# Altium schematic sheet 8051.SchDoc
size A3
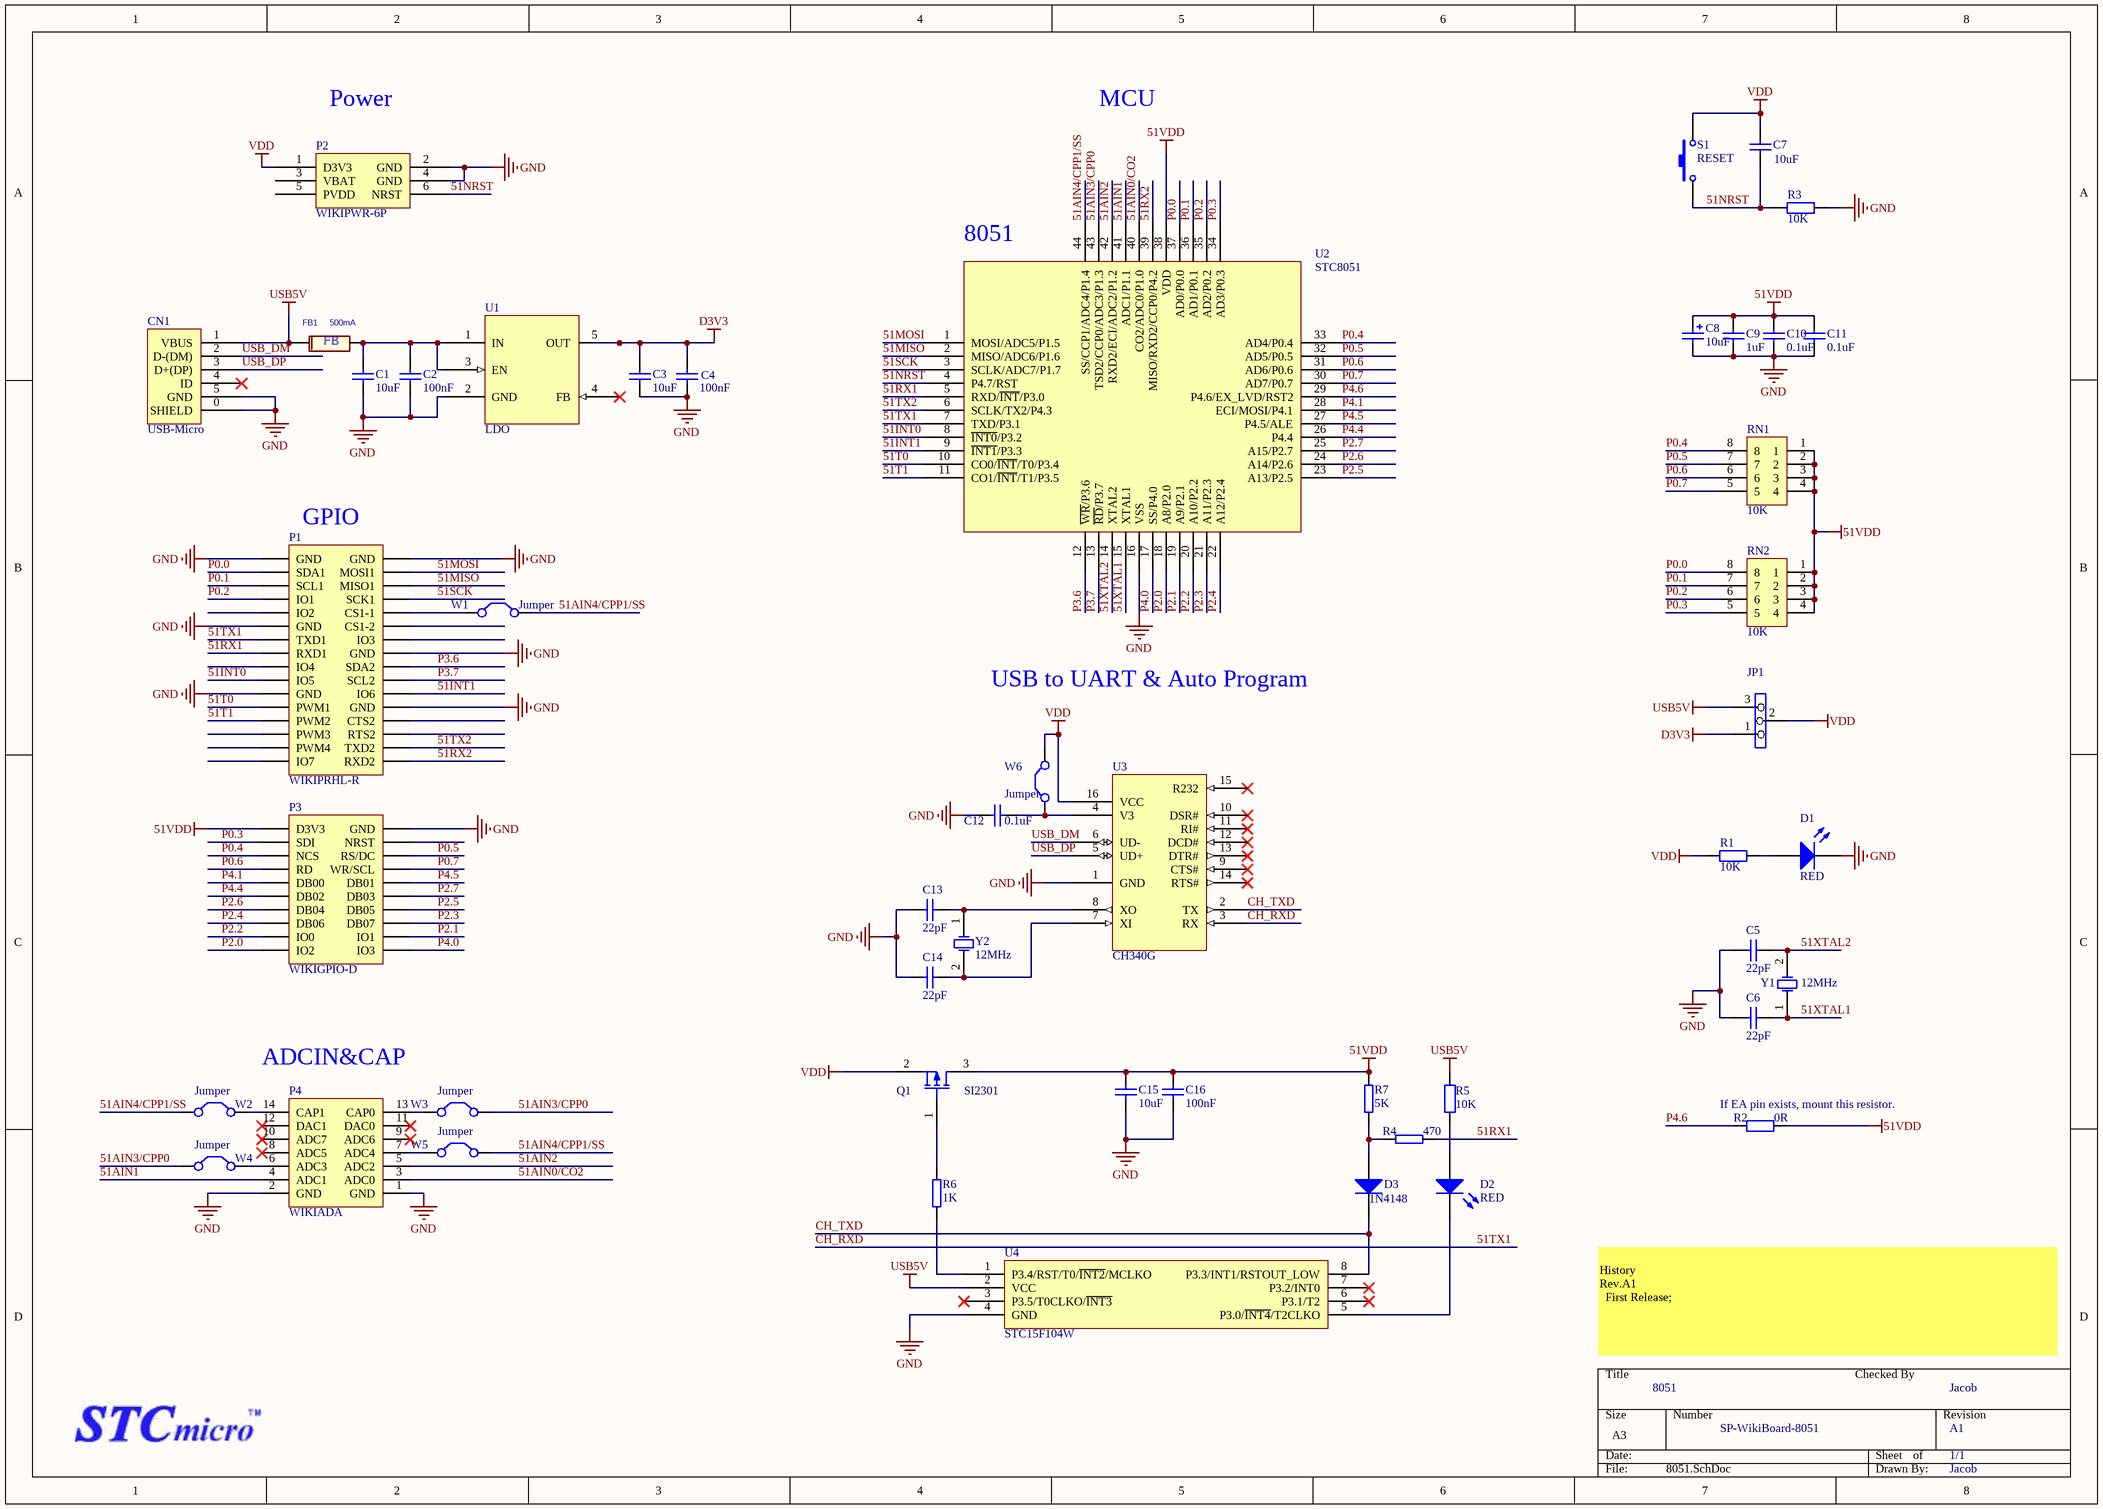
[diagram p0: 8051.SchDoc]

## Parts
C1  10uF  [C0805]
C2  100nF  [C0603L]
C3  10uF  [C0805]
C4  100nF  [C0603L]
C5  22pF  [C0603L]
C6  22pF  [C0603L]
C7  10uF  [C0805]
C8  10uF  [SMT_C_Tantalum_B]
C9  1uF  [C0603L]
C10  0.1uF  [C0603L]
C11  0.1uF  [C0603L]
C12  0.1uF  [C0603L]
C13  22pF  [C0603L]
C14  22pF  [C0603L]
C15  10uF  [C0805]
C16  100nF  [C0603L]
CN1  USB-Micro  [USB_MICRO_5S_B]
D1  RED  [SMT_LED_0603]
D2  RED  [SMT_LED_0603]
D3  1N4148  [SOD80]
FB1  500mA  [R1206]
JP1  JP3  [SIP3]  (value not drawn)
P1  WIKIPRHL-R  [WIKIPRHL-R]
P2  WIKIPWR-6P  [WIKIPWR-6P]
P3  WIKIGPIO-D  [WIKIGPIO-D]
P4  WIKIADA  [WIKIADA]
Q1  SI2301  [SOT-23A]
R1  10K  [R0603]
R2  0R  [R0603]
R3  10K  [R0603]
R4  470  [R0603]
R5  10K  [R0603]
R6  1K  [R0603]
R7  5K  [R0603]
RN1  value 10K  [RN1X4/0603]  (hidden comment: RN4)
RN2  value 10K  [RN1X4/0603]  (hidden comment: RN4)
S1  RESET  [KEY-2x4-SMD]
U1  LDO  [SOT23-5]
U2  STC8051  [TQFP44]
U3  CH340G  [SO16_M]
U4  STC15F104W  [SO8_M]
W1  Jumper  [Solderbridge]
W2  Jumper  [Solderbridge]
W3  Jumper  [Solderbridge]
W4  Jumper  [Solderbridge]
W5  Jumper  [Solderbridge]
W6  Jumper  [Solderbridge]
Y1  12MHz  [XTAL0602]
Y2  12MHz  [XTAL_32]

## Nets
51VDD: C8.1 C9.2 C10.2 C11.2 C15.1 C16.1 P3.1(D3V3) Q1.3(D) R2.2 R7.1 RN1.1 RN1.2 RN1.3 RN1.4 RN2.1 RN2.2 RN2.3 RN2.4 U2.38(VDD)
D3V3: C3.1 C4.1 JP1.1 U1.5(OUT)
GND: C1.2 C2.2 C3.2 C4.2 C5.1 C6.1 C8.2 C9.1 C10.1 C11.1 C12.1 C13.1 C14.1 C15.2 C16.2 CN1.0(SHIELD) CN1.5(GND) D1.2(K) P1.1(GND) P1.2(GND) P1.11(GND) P1.16(GND) P1.21(GND) P1.24(GND) P2.2(GND) P2.4(GND) P3.2(GND) P4.1(GND) P4.2(GND) R3.1 U1.2(GND) U2.16(VSS) U3.1(GND) U4.4(GND)
USB5V: CN1.1(VBUS) FB1.1 JP1.3 R5.2 U4.2(VCC)
VDD: C7.2 JP1.2 P2.1(D3V3) Q1.2(S) R1.2 S1.2 U3.16(VCC) W6.1(C1)
51AIN0/CO2: P4.3(ADC0) U2.40(CO2/ADC0/P1.0)
51AIN1: P4.4(ADC1) U2.41(ADC1/P1.1)
51AIN2: P4.5(ADC2) U2.42(RXD2/ECI/ADC2/P1.2)
51AIN3/CPP0: U2.43(TSD2/CCP0/ADC3/P1.3) W3.2(C2) W4.1(C1)
51AIN4/CPP1/SS: U2.44(SS/CCP1/ADC4/P1.4) W1.1(C1) W2.1(C1) W5.2(C2)
51INT0: P1.19(IO5) U2.8(~{INT0}/P3.2)
51INT1: P1.22(IO6) U2.9(~{INT1}/P3.3)
51MISO: P1.6(MISO1) U2.2(MISO/ADC6/P1.6)
51MOSI: P1.4(MOSI1) U2.1(MOSI/ADC5/P1.5)
51NRST: C7.1 P2.6(NRST) R3.2 S1.1 U2.4(P4.7/RST)
51RX1: P1.15(RXD1) R4.2 U2.5(RXD/~{INT}/P3.0)
51RX2: P1.32(RXD2) U2.39(MISO/RXD2/CCP0/P4.2)
51SCK: P1.8(SCK1) U2.3(SCLK/ADC7/P1.7)
51T0: P1.23(PWM1) U2.10(CO0/~{INT}/T0/P3.4)
51T1: P1.25(PWM2) U2.11(CO1/~{INT}/T1/P3.5)
51TX1: P1.13(TXD1) U2.7(TXD/P3.1) U3.3(RX)  [also labelled CH_RXD]
51TX2: P1.30(TXD2) U2.6(SCLK/TX2/P4.3)
51XTAL1: C6.2 U2.15(XTAL1) Y1.1(OSC1)
51XTAL2: C5.2 U2.14(XTAL2) Y1.2(OSC2)
CH_TXD: D3.2(K) U3.2(TX) U4.8(P3.3/INT1/RSTOUT_LOW)
P0.0: P1.3(SDA1) RN2.8 U2.37(AD0/P0.0)
P0.1: P1.5(SCL1) RN2.7 U2.36(AD1/P0.1)
P0.2: P1.7(IO1) RN2.6 U2.35(AD2/P0.2)
P0.3: P3.3(SDI) RN2.5 U2.34(AD3/P0.3)
P0.4: P3.5(NCS) RN1.8 U2.33(AD4/P0.4)
P0.5: P3.6(RS/DC) RN1.7 U2.32(AD5/P0.5)
P0.6: P3.7(RD) RN1.6 U2.31(AD6/P0.6)
P0.7: P3.8(WR/SCL) RN1.5 U2.30(AD7/P0.7)
P2.0: P3.19(IO2) U2.18(A8/P2.0)
P2.1: P3.18(IO1) U2.19(A9/P2.1)
P2.2: P3.17(IO0) U2.20(A10/P2.2)
P2.3: P3.16(DB07) U2.21(A11/P2.3)
P2.4: P3.15(DB06) U2.22(A12/P2.4)
P2.5: P3.14(DB05) U2.23(A13/P2.5)
P2.6: P3.13(DB04) U2.24(A14/P2.6)
P2.7: P3.12(DB03) U2.25(A15/P2.7)
P3.6: P1.18(SDA2) U2.12(~{WR}/P3.6)
P3.7: P1.20(SCL2) U2.13(~{RD}/P3.7)
P4.0: P3.20(IO3) U2.17(SS/P4.0)
P4.1: P3.9(DB00) U2.28(ECI/MOSI/P4.1)
P4.4: P3.11(DB02) U2.26(P4.4)
P4.5: P3.10(DB01) U2.27(P4.5/ALE)
P4.6: R2.1 U2.29(P4.6/EX_LVD/RST2)
USB_DM: CN1.2(D-(DM)) U3.6(UD-)
USB_DP: CN1.3(D+(DP)) U3.5(UD+)
NetC1_1: C1.1 C2.1 FB1.2 U1.1(IN) U1.3(EN)
NetC12_2: C12.2 U3.4(V3) W6.2(C2)
NetC13_2: C13.2 U3.8(XO) Y2.1(OSC1)
NetC14_2: C14.2 U3.7(XI) Y2.2(OSC2)
NetD1_1: D1.1(A) R1.1
NetD2_1: D2.1(A) R5.1
NetD2_2: D2.2(K) U4.5(P3.0/~{INT4}/T2CLKO)
NetD3_1: D3.1(A) R4.1 R7.2
NetP1_10: P1.10(CS1-1) W1.2(C2)
NetP4_6: P4.6(ADC3) W4.2(C2)
NetP4_7: P4.7(ADC4) W5.1(C1)
NetP4_13: P4.13(CAP0) W3.1(C1)
NetP4_14: P4.14(CAP1) W2.2(C2)
NetQ1_1: Q1.1(G) R6.2
NetR6_1: R6.1 U4.1(P3.4/RST/T0/~{INT2}/MCLKO)

Not connected (* = marked no-connect by the designer): CN1 4(ID)*; P1 9(IO2) 12(CS1-2) 14(IO3) 17(IO4) 26(CTS2) 27(PWM3) 28(RTS2) 29(PWM4) 31(IO7); P2 3(VBAT) 5(PVDD); P3 4(NRST); P4 8(ADC5)* 9(ADC6)* 10(ADC7)* 11(DAC0)* 12(DAC1)*; U1 4(FB)*; U3 9(CTS#)* 10(DSR#)* 11(RI#)* 12(DCD#)* 13(DTR#)* 14(RTS#)* 15(R232)*; U4 3(P3.5/T0CLKO/~{INT3})* 6(P3.1/T2)* 7(P3.2/INT0)*

## Notes on the sheet
- Power
- MCU
- (near U2) 8051
- (near P1) GPIO
- USB to UART & Auto Program
- ADCIN&CAP
- (near R2) If EA pin exists, mount this resistor.
- History
  Rev.A1
  First Release;
- 8051
- Checked By
- Jacob
- SP-WikiBoard-8051
- A1
- 1/1

## Library data of the parts
C1-C7 C9-C16 = Cap: Capacitor; Published: 8-Jun-2000; LatestRevisionDate: 17-Jul-2002; LatestRevisionNote: Re-released for DXP Platform.; PackageReference: RAD-0.3
  C1 C3 C7 C15: Publisher: Altium Limited; Value: 10uF
  C2 C4 C16: Publisher: Altium Limited; Value: 100nF
  C5 C6 C13 C14: Publisher: Altium Limited; Value: 22pF
  C9: Publisher: Altium Limited; Value: 1uF
  C10 C11: Publisher: Altium Limited; Value: 0.1uF
  C12: Value: 0.1uF
C8 = Cap Pol1: Polarized Capacitor (Radial); Published: 8-Jun-2000; LatestRevisionDate: 17-Jul-2002; LatestRevisionNote: Re-released for DXP Platform.; PackageReference: RB7.6-15; Publisher: Altium Limited; Value: 10uF
D1 D2 = LED0: Typical INFRARED GaAs LED; Published: 8-Jun-2000; LatestRevisionDate: 08-Jul-2005; LatestRevisionNote: Mech Layer 1 removed.; PackageReference: LED-0; Publisher: Altium Limited
D3 = Diode 1N4148: High Conductance Fast Diode; Published: 8-Jun-2000; LatestRevisionDate: 17-Jul-2002; LatestRevisionNote: Re-released for DXP Platform.; DatasheetVersion: 1997; PackageReference: DO-35; Publisher: Altium Limited; PackageDescription: Diode, Axial; Body 3.8 x 1.9 mm (LxDia. max), Lead Dia. 0.53 mm (max); Code_JEDEC: DO-204-AH; ComponentLink1Description: Manufacturer Link; ComponentLink1URL: http://www.fairchildsemi.com/; ComponentLink2Description: Datasheet; ComponentLink2URL: http://www.fairchildsemi.com/ds/1N%2F1N4148.pdf
FB1 = FB: Ferrite Beads Inductors Impedance:120Ω±25% Rated Current:1500mA DC Resistance:0.095Ω; Manufacturer: muRata; Manufacturer Part Number: BLM15EG121SN1
P1 = WIKIPRHL-R: Header, 16-Pin, Dual row; LatestRevisionDate: 17-Jul-2002; LatestRevisionNote: Re-released for DXP Platform.; Publisher: Altium Limited
P2 = WIKIPWR-6P: PWR HDR
P3 = WIKIGPIO-D: Header, 9-Pin, Dual row; LatestRevisionDate: 17-Jul-2002; LatestRevisionNote: Re-released for DXP Platform.; Publisher: Altium Limited
P4 = WIKIADA: Header, 14-Pin, Dual row
Q1 = SI2301: P-Channel MOSFET; Published: 8-Jun-2000; LatestRevisionDate: 17-Jul-2002; LatestRevisionNote: Re-released for DXP Platform.; PackageVersion: 1995/1996; PackageReference: E3; Publisher: Altium Limited; PackageDescription: TO, Flat Index; 3 In-Line, Axial Leads; Body Dia. 4.6mm; Lead Dia. 0.5 mm (max)
R1-R3 R5 = Res2: Resistor; Published: 8-Jun-2000; LatestRevisionDate: 17-Jul-2002; LatestRevisionNote: Re-released for DXP Platform.; PackageReference: AXIAL-0.4; Publisher: Altium Limited
  R1 R3 R5: Value: 10K
  R2: Value: 0R
R4 R6 R7 = SMT_R_0402: Surface mount resistor 0402
RN1 RN2 = RN4: Res Network
S1 = SW-PB: Switch; Published: 24-Mar-1999; LatestRevisionDate: 17-Jul-2002; LatestRevisionNote: Re-released for DXP Platform.; PackageReference: SPST-2; Publisher: Altium Limited
U1 = LDO-SOT23-5: General LDO SOT23-5
U2 = STC12LE5A
U3 = CH340G: USB to UART IC
U4 = STC15F101W_SOP8_DIP8
W1-W6 = Jumper: Jumper Wire; Published: 24-Mar-1999; LatestRevisionDate: 17-Jul-2002; LatestRevisionNote: Re-released for DXP Platform.; PackageReference: RAD-0.2; Publisher: Altium Limited
Y1 Y2 = XTAL: Crystal Oscillator; Published: 8-Jun-2000; LatestRevisionDate: 17-Jul-2002; LatestRevisionNote: Re-released for DXP Platform.; PackageReference: R38; Publisher: Altium Limited